# Altium schematic sheet RGB LED.SchDoc: RGB LED
size A4; Date: 2017-02-06; DocumentNumber: 16; Revision: A; SheetNumber: 16; SheetTotal: 16; DesignedBy: Craig Comberbach
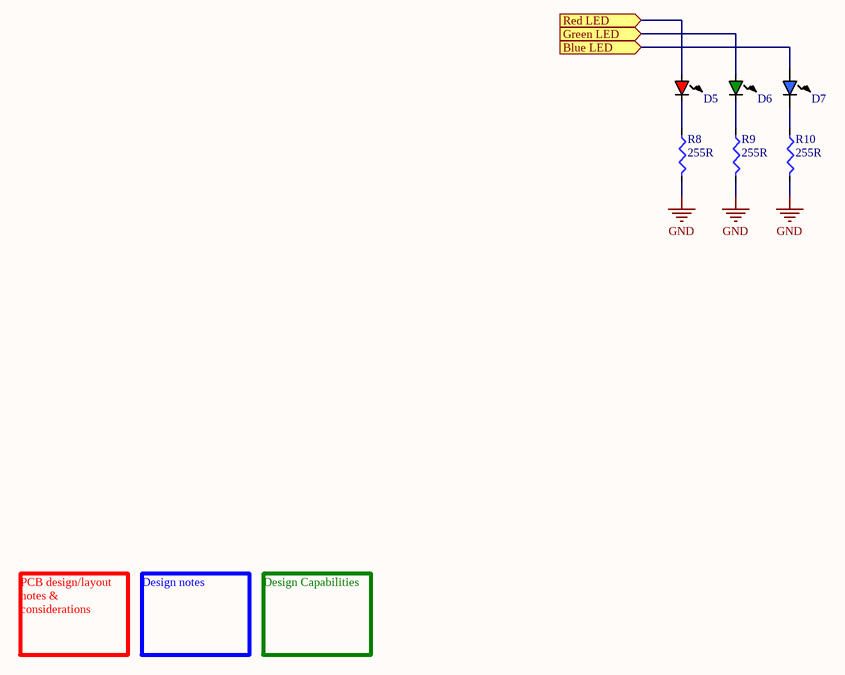
[diagram p0: RGB LED.SchDoc]

## Parts
D5  Red LED 1206  [LED - 1206 Red]  (value not drawn)
D6  Green LED 1206  [LED - 1206 Green]  (value not drawn)
D7  Blue LED 1206  [LED - 1206 Blue]  (value not drawn)
R8  Resistance (Ohms): 255R  [R0805]  (hidden comment: 255R 0805 1%)
R9  Resistance (Ohms): 255R  [R0805]  (hidden comment: 255R 0805 1%)
R10  Resistance (Ohms): 255R  [R0805]  (hidden comment: 255R 0805 1%)

## Ports
Blue LED (in), Green LED (in), Red LED (in)

## Nets
GND: R8.1 R9.1 R10.1
Blue LED: D7.1 ; port Blue LED
Green LED: D6.1 ; port Green LED
Red LED: D5.1 ; port Red LED
NetD5_2: D5.2 R8.2
NetD6_2: D6.2 R9.2
NetD7_2: D7.2 R10.2

## Notes on the sheet
- PCB design/layout notes & considerations
- Design notes
- Design Capabilities
- Repository Version
- BOM/Variant

## Library data of the parts
D5 = Red LED 1206: Manufacturer: Kingbright; Manufacturer Part Number: APT3216SRCPRV; Wavelength - Dominant: 640nm; Wavelength - Peak: 660nm; Millicandela Rating: 80mcd; Voltage - Forward (Vf) (Typ): 1.85V; Current - Test: 20mA; Viewing Angle: 120°; Lens Type: Clear; Lens Style/Size: Rectangle with Flat Top, 2mm x 1.6mm; Value: Red LED 1206; Supplier 1: Digi-Key; RoHS: RoHS Compliant; Category: Optoelectronics; Stock 1: 29504; Pricing 1: 1=0.2, 10=0.149, 25=0.1188, 100=0.1073, 250=0.099, 500=0.0891 (USD); Packaging: Cut Tape (CT); Color: Red; Package / Case: 1206 (3216 Metric); Size / Dimension: 3.20mm L x 1.60mm W; Height: 0.75mm; Mounting Type: Surface Mount; Luminous Flux @ Current - Test: -; ComponentLink1URL: http://www.kingbrightusa.com/images/catalog/SPEC/APT3216SRCPRV.pdf; ComponentLink1Description: Spec Sheet; Supplier Part Number 1: 754-1142-1-ND
D6 = Green LED 1206: Manufacturer: Kingbright; Manufacturer Part Number: APL3015SGC-F01; Wavelength - Dominant: 568nm; Wavelength - Peak: 565nm; Millicandela Rating: 20mcd; Voltage - Forward (Vf) (Typ): 2.2V; Current - Test: 20mA; Viewing Angle: 70°; Lens Type: Clear; Lens Style/Size: Rectangle with Flat Top, 2mm x 1.6mm; Value: Green LED 1206; Supplier 1: Digi-Key; Supplier Part Number 1: 754-1111-1-ND; RoHS: RoHS Compliant; Category: Optoelectronics; Stock 1: 31522; Pricing 1: 1=0.21, 10=0.156, 25=0.1248, 100=0.1127, 250=0.104, 500=0.09362 (CAD); Packaging: Cut Tape (CT); Color: Green; Package / Case: 2-SMD, No Lead; Size / Dimension: 3.00mm L x 1.50mm W; Height: 1.40mm; Mounting Type: Surface Mount; Luminous Flux @ Current - Test: -; ComponentLink1URL: http://www.kingbrightusa.com/images/catalog/SPEC/APL3015SGC-F01.pdf; ComponentLink1Description: Spec Sheet
D7 = Blue LED 1206: Single Colour; Manufacturer: Lite-On Inc; Manufacturer Part Number: LTST-C150TBKT; Wavelength - Dominant: 470nm; Wavelength - Peak: 468nm; Millicandela Rating: 104mcd; Voltage - Forward (Vf) (Typ): 3.3V; Current - Test: 20mA; Viewing Angle: 130°; Lens Transparency: Clear; Lens Color: Colorless; Lens Style/Size: Rectangle with Flat Top, 2.06mm x 1.60mm; Value: Blue LED 1206; Supplier 1: Digi-Key; RoHS: RoHS Compliant; Category: Optoelectronics; Stock 1: 185598; Pricing 1: 1=0.65, 10=0.485, 100=0.2567, 250=0.1816, 500=0.15498, 1000=0.12108 (CAD); Packaging: Cut Tape (CT); Color: Blue; Package / Case: 1206 (3216 Metric); Supplier Device Package: 1206; Size / Dimension: 3.20mm L x 1.60mm W; Height (Max): 1.10mm; Mounting Type: Surface Mount; ComponentLink1URL: http://optoelectronics.liteon.com/upload/download/DS22-2000-026/S_110_LTST-C150TBKT(0630).pdf; ComponentLink1Description: Spec Sheet; Supplier Part Number 1: 160-1643-1-ND
R8-R10 = 255R 0805 1%: 1/8W; Manufacturer P/N: ERJ-6ENF2550V; Manufacturer: Panasonic Electronic Components; Vendor: Digi-Key; Vendor P/N: P255CCT-ND; Power (Watts): 0.125W, 1/8W; Temperature Coefficient: ±100ppm/°C; Technology: SMT; Value: 255R 0805 1%; Package: 0805; Ptolerance: 1%; Supplier 1: Digi-Key; Supplier Part Number 1: P255CCT-ND; Manufacturer Part Number: ERJ-6ENF2550V; RoHS: RoHS Compliant; Category: Resistors; Stock 1: 94483; Pricing 1: 1=0.12, 50=0.0354, 100=0.027, 250=0.02, 500=0.01476, 1000=0.00985, 2500=0.00831 (CAD); Packaging: Cut Tape (CT); Tolerance: ±1%; Composition: Thick Film; Features: -; Package / Case: 0805 (2012 Metric); Supplier Device Package: 0805; Size / Dimension: 0.079" L x 0.049" W (2.00mm x 1.25mm); Height: 0.028" (0.70mm); Number of Terminations: 2; ComponentLink1URL: http://industrial.panasonic.com/www-cgi/jvcr13pz.cgi?E+PZ+3+AOA0002+ERJ6ENF2550V+7+WW; ComponentLink1Description: Spec Sheet